# Altium project tianjin.PrjPcb
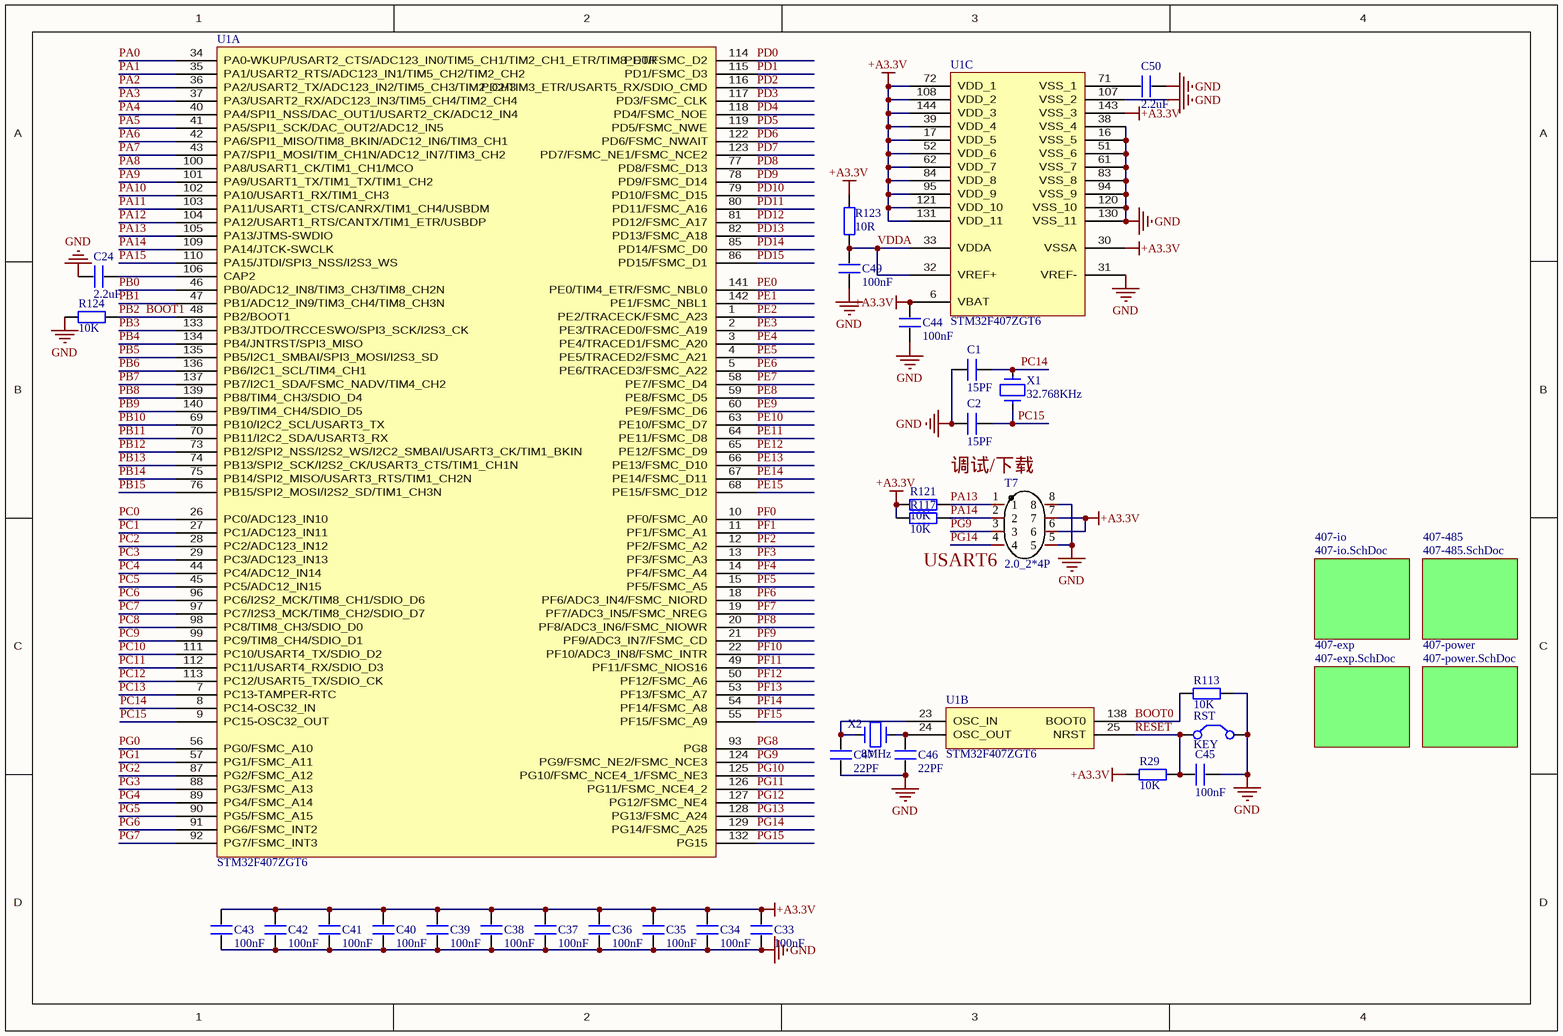
[diagram p0: 407-cpu .schdoc]
5 sheets, 300 parts. Net scope: global (net labels, ports and power ports of the same name join across sheets).
Board file: tianjin2025_4.PcbDoc
Sheets:
  407-cpu .schdoc
    407-io = 407-io.schdoc
    407-485 = 407-485.schdoc
    407-exp = 407-exp.schdoc
    407-power = 407-power.schdoc

## Sheet 407-cpu .schdoc
size A4

### Parts
C1  15PF
C2  15PF
C24  2.2uF
C33  100nF
C34  100nF
C35  100nF
C36  100nF
C37  100nF
C38  100nF
C39  100nF
C40  100nF
C41  100nF
C42  100nF
C43  100nF
C44  100nF
C45  100nF
C46  22PF
C47  22PF
C49  100nF
C50  2.2uF
R29  10K
R113  10K
R117  10K
R121  10K
R123  10R
R124  10K
RST  KEY
T7  2.0_2*4P  [2.0_2*4P]
U1  STM32F407ZGT6  (parts A,B,C of 3)
X1  32.768KHz
X2  8MHz

### Sub-sheets
407-485 = 407-485.SchDoc: no entries
407-exp = 407-exp.SchDoc: no entries
407-io = 407-io.SchDoc: no entries
407-power = 407-power.SchDoc: no entries

### Nets
+A3.3V: C33.2 C34.2 C35.2 C36.2 C37.2 C38.2 C39.2 C40.2 C41.2 C42.2 C43.2 C44.2 R29.1 R117.2 R121.2 R123.1 T7.6 T7.7 U1.6(VBAT) U1.17(VDD_5) U1.30(VSSA) U1.39(VDD_4) U1.52(VDD_6) U1.62(VDD_7) U1.72(VDD_1) U1.84(VDD_8) U1.95(VDD_9) U1.108(VDD_2) U1.121(VDD_10) U1.131(VDD_11) U1.143(VSS_3) U1.144(VDD_3)
GND: C1.2 C2.2 C24.1 C33.1 C34.1 C35.1 C36.1 C37.1 C38.1 C39.1 C40.1 C41.1 C42.1 C43.1 C44.1 C45.1 C46.1 C47.1 C49.1 C50.2 R113.2 R124.1 RST.2(C2) T7.5 T7.8 U1.16(VSS_5) U1.31(VREF-) U1.38(VSS_4) U1.51(VSS_6) U1.61(VSS_7) U1.83(VSS_8) U1.94(VSS_9) U1.107(VSS_2) U1.120(VSS_10) U1.130(VSS_11)
BOOT0: R113.1 U1.138(BOOT0)
BOOT1: R124.2 U1.48(PB2/BOOT1)  [also labelled PB2]
PA0: U1.34(PA0-WKUP/USART2_CTS/ADC123_IN0/TIM5_CH1/TIM2_CH1_ETR/TIM8_ETR)
PA1: U1.35(PA1/USART2_RTS/ADC123_IN1/TIM5_CH2/TIM2_CH2)
PA2: U1.36(PA2/USART2_TX/ADC123_IN2/TIM5_CH3/TIM2_CH3)
PA3: U1.37(PA3/USART2_RX/ADC123_IN3/TIM5_CH4/TIM2_CH4)
PA4: U1.40(PA4/SPI1_NSS/DAC_OUT1/USART2_CK/ADC12_IN4)
PA5: U1.41(PA5/SPI1_SCK/DAC_OUT2/ADC12_IN5)
PA6: U1.42(PA6/SPI1_MISO/TIM8_BKIN/ADC12_IN6/TIM3_CH1)
PA7: U1.43(PA7/SPI1_MOSI/TIM_CH1N/ADC12_IN7/TIM3_CH2)
PA8: U1.100(PA8/USART1_CK/TIM1_CH1/MCO)
PA9: U1.101(PA9/USART1_TX/TIM1_TX/TIM1_CH2)
PA10: U1.102(PA10/USART1_RX/TIM1_CH3)
PA11: U1.103(PA11/USART1_CTS/CANRX/TIM1_CH4/USBDM)
PA12: U1.104(PA12/USART1_RTS/CANTX/TIM1_ETR/USBDP)
PA13: R121.1 T7.1 U1.105(PA13/JTMS-SWDIO)
PA14: R117.1 T7.2 U1.109(PA14/JTCK-SWCLK)
PA15: U1.110(PA15/JTDI/SPI3_NSS/I2S3_WS)
PB0: U1.46(PB0/ADC12_IN8/TIM3_CH3/TIM8_CH2N)
PB1: U1.47(PB1/ADC12_IN9/TIM3_CH4/TIM8_CH3N)
PB3: U1.133(PB3/JTDO/TRCCESWO/SPI3_SCK/I2S3_CK)
PB4: U1.134(PB4/JNTRST/SPI3_MISO)
PB5: U1.135(PB5/I2C1_SMBAI/SPI3_MOSI/I2S3_SD)
PB6: U1.136(PB6/I2C1_SCL/TIM4_CH1)
PB7: U1.137(PB7/I2C1_SDA/FSMC_NADV/TIM4_CH2)
PB8: U1.139(PB8/TIM4_CH3/SDIO_D4)
PB9: U1.140(PB9/TIM4_CH4/SDIO_D5)
PB10: U1.69(PB10/I2C2_SCL/USART3_TX)
PB11: U1.70(PB11/I2C2_SDA/USART3_RX)
PB12: U1.73(PB12/SPI2_NSS/I2S2_WS/I2C2_SMBAI/USART3_CK/TIM1_BKIN)
PB13: U1.74(PB13/SPI2_SCK/I2S2_CK/USART3_CTS/TIM1_CH1N)
PB14: U1.75(PB14/SPI2_MISO/USART3_RTS/TIM1_CH2N)
PB15: U1.76(PB15/SPI2_MOSI/I2S2_SD/TIM1_CH3N)
PC0: U1.26(PC0/ADC123_IN10)
PC1: U1.27(PC1/ADC123_IN11)
PC2: U1.28(PC2/ADC123_IN12)
PC3: U1.29(PC3/ADC123_IN13)
PC4: U1.44(PC4/ADC12_IN14)
PC5: U1.45(PC5/ADC12_IN15)
PC6: U1.96(PC6/I2S2_MCK/TIM8_CH1/SDIO_D6)
PC7: U1.97(PC7/I2S3_MCK/TIM8_CH2/SDIO_D7)
PC8: U1.98(PC8/TIM8_CH3/SDIO_D0)
PC9: U1.99(PC9/TIM8_CH4/SDIO_D1)
PC10: U1.111(PC10/USART4_TX/SDIO_D2)
PC11: U1.112(PC11/USART4_RX/SDIO_D3)
PC12: U1.113(PC12/USART5_TX/SDIO_CK)
PC13: U1.7(PC13-TAMPER-RTC)
PC14: C1.1 U1.8(PC14-OSC32_IN) X1.1
PC15: C2.1 U1.9(PC15-OSC32_OUT) X1.2
PD0: U1.114(PD0/FSMC_D2)
PD1: U1.115(PD1/FSMC_D3)
PD2: U1.116(PD2/TIM3_ETR/USART5_RX/SDIO_CMD)
PD3: U1.117(PD3/FSMC_CLK)
PD4: U1.118(PD4/FSMC_NOE)
PD5: U1.119(PD5/FSMC_NWE)
PD6: U1.122(PD6/FSMC_NWAIT)
PD7: U1.123(PD7/FSMC_NE1/FSMC_NCE2)
PD8: U1.77(PD8/FSMC_D13)
PD9: U1.78(PD9/FSMC_D14)
PD10: U1.79(PD10/FSMC_D15)
PD11: U1.80(PD11/FSMC_A16)
PD12: U1.81(PD12/FSMC_A17)
PD13: U1.82(PD13/FSMC_A18)
PD14: U1.85(PD14/FSMC_D0)
PD15: U1.86(PD15/FSMC_D1)
PE0: U1.141(PE0/TIM4_ETR/FSMC_NBL0)
PE1: U1.142(PE1/FSMC_NBL1)
PE2: U1.1(PE2/TRACECK/FSMC_A23)
PE3: U1.2(PE3/TRACED0/FSMC_A19)
PE4: U1.3(PE4/TRACED1/FSMC_A20)
PE5: U1.4(PE5/TRACED2/FSMC_A21)
PE6: U1.5(PE6/TRACED3/FSMC_A22)
PE7: U1.58(PE7/FSMC_D4)
PE8: U1.59(PE8/FSMC_D5)
PE9: U1.60(PE9/FSMC_D6)
PE10: U1.63(PE10/FSMC_D7)
PE11: U1.64(PE11/FSMC_D8)
PE12: U1.65(PE12/FSMC_D9)
PE13: U1.66(PE13/FSMC_D10)
PE14: U1.67(PE14/FSMC_D11)
PE15: U1.68(PE15/FSMC_D12)
PF0: U1.10(PF0/FSMC_A0)
PF1: U1.11(PF1/FSMC_A1)
PF2: U1.12(PF2/FSMC_A2)
PF3: U1.13(PF3/FSMC_A3)
PF4: U1.14(PF4/FSMC_A4)
PF5: U1.15(PF5/FSMC_A5)
PF6: U1.18(PF6/ADC3_IN4/FSMC_NIORD)
PF7: U1.19(PF7/ADC3_IN5/FSMC_NREG)
PF8: U1.20(PF8/ADC3_IN6/FSMC_NIOWR)
PF9: U1.21(PF9/ADC3_IN7/FSMC_CD)
PF10: U1.22(PF10/ADC3_IN8/FSMC_INTR)
PF11: U1.49(PF11/FSMC_NIOS16)
PF12: U1.50(PF12/FSMC_A6)
PF13: U1.53(PF13/FSMC_A7)
PF14: U1.54(PF14/FSMC_A8)
PF15: U1.55(PF15/FSMC_A9)
PG0: U1.56(PG0/FSMC_A10)
PG1: U1.57(PG1/FSMC_A11)
PG2: U1.87(PG2/FSMC_A12)
PG3: U1.88(PG3/FSMC_A13)
PG4: U1.89(PG4/FSMC_A14)
PG5: U1.90(PG5/FSMC_A15)
PG6: U1.91(PG6/FSMC_INT2)
PG7: U1.92(PG7/FSMC_INT3)
PG8: U1.93(PG8)
PG9: T7.3 U1.124(PG9/FSMC_NE2/FSMC_NCE3)
PG10: U1.125(PG10/FSMC_NCE4_1/FSMC_NE3)
PG11: U1.126(PG11/FSMC_NCE4_2)
PG12: U1.127(PG12/FSMC_NE4)
PG13: U1.128(PG13/FSMC_A24)  [project net GPS]
PG14: T7.4 U1.129(PG14/FSMC_A25)
PG15: U1.132(PG15)
RESET: C45.2 R29.2 RST.1(C1) U1.25(NRST)
VDDA: C49.2 R123.2 U1.32(VREF+) U1.33(VDDA)
NetC24_2: C24.2 U1.106(CAP2)
NetC46_2: C46.2 U1.24(OSC_OUT) X2.2
NetC47_2: C47.2 U1.23(OSC_IN) X2.1
NetC50_1: C50.1 U1.71(VSS_1)

### Notes on the sheet
- 调试/下载
- USART6

### Library data of the parts
C1 C2 C24 C33-C47 C49 C50 = C
R29 R113 R117 R121 R123 R124 = Res2: Resistor
RST = Jumper: Jumper Wire; Published: 24-Mar-1999; LatestRevisionDate: 17-Jul-2002; LatestRevisionNote: Re-released for DXP Platform.; PackageReference: RAD-0.2; Publisher: Altium Limited
U1 = STM32F103ZET6_1
X1 X2 = XTAL: Crystal Oscillator

## Sheet 407-io.schdoc
size A4
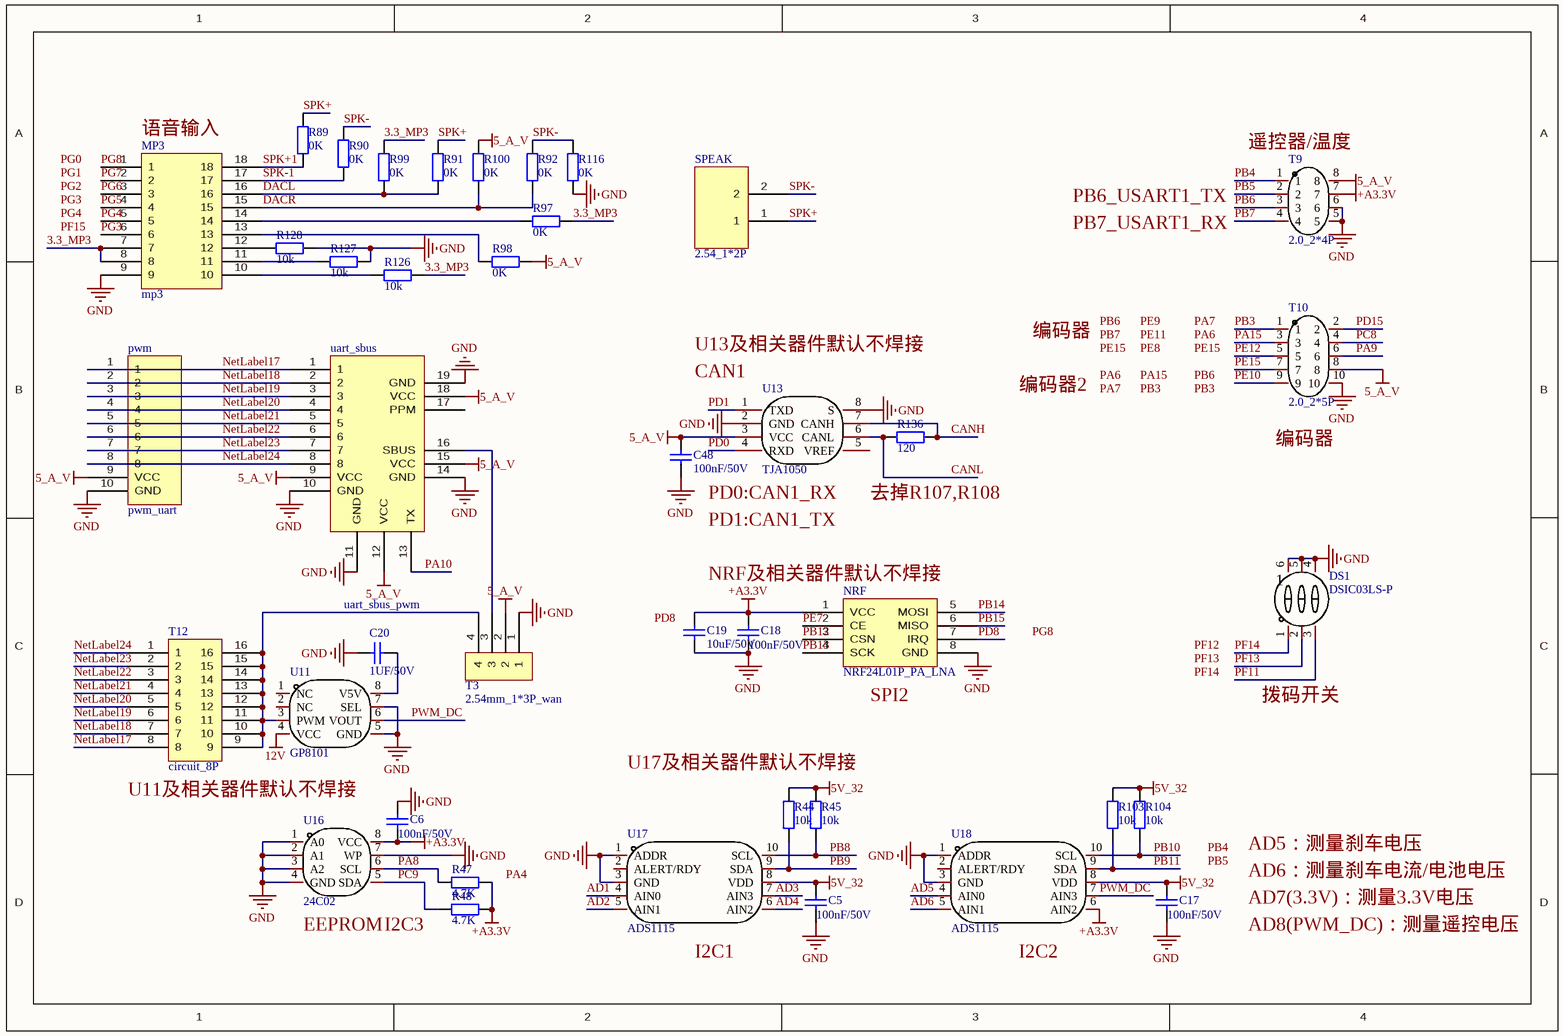
[diagram p1: 407-io.schdoc]

### Parts
C5  100nF/50V
C6  100nF/50V
C17  100nF/50V
C18  100nF/50V
C19  10uF/50V
C20  1UF/50V
C48  100nF/50V
DS1  DSIC03LS-P  [DS1040-03RN]
MP3  mp3  [MP3]
NRF  NRF24L01P_PA_LNA  [NRF24L01P_PA_LNA]
pwm  pwm_uart  [pwm_uart]
R44  10k  [R0603_L]
R45  10k  [R0603_L]
R47  4.7K
R48  4.7K
R89  0K  [R0603_L]
R90  0K  [R0603_L]
R91  0K  [R0603_L]
R92  0K  [R0603_L]
R97  0K  [R0603_L]
R98  0K  [R0603_L]
R99  0K  [R0603_L]
R100  0K  [R0603_L]
R103  10k  [R0603_L]
R104  10k  [R0603_L]
R116  0K  [R0603_L]
R126  10k  [R0603_L]
R127  10k  [R0603_L]
R128  10k  [R0603_L]
R136  120
SPEAK  2.54_1*2P  [2.54_1*2P]
T3  2.54mm_1*3P_wan
T9  2.0_2*4P  [2.0_2*4P]
T10  2.0_2*5P  [2.0_2*5P]
T12  circuit_8P  [circuit_8P]
U11  GP8101  [GP8101]
U13  TJA1050  [TJA1050]
U16  24C02  [24C02]
U17  ADS1115  [ADS1115]
U18  ADS1115  [ADS1115]
uart_sbus  uart_sbus_pwm  [uart_sbus_pwm]

### Nets
5_A_V: C48.2 pwm.9(VCC) R98.2 R100.2 T3.2 T9.8 T10.8 U13.3(VCC) uart_sbus.9(VCC) uart_sbus.12(VCC) uart_sbus.15(VCC) uart_sbus.18(VCC)
5V_32: C5.1 C17.1 R44.1 R45.1 R103.1 R104.1 U17.8(VDD) U18.8(VDD)
12V: U11.4(VCC)
+A3.3V: C6.2 C18.1 C19.1 NRF.1(VCC) R47.2 R48.2 T9.7 U16.8(VCC) U18.6(AIN2)
GND: C5.2 C6.1 C17.2 C18.2 C19.2 C20.2 C48.1 DS1.4(PIN4) DS1.5(PIN5) DS1.6(PIN6) MP3.9 NRF.8(GND) pwm.10(GND) R116.1 R127.2 R128.2 T3.1 T9.5 T9.6 T10.10 U11.5(GND) U11.7(SEL) U13.2(GND) U13.8(S) U16.1(A0) U16.2(A1) U16.3(A2) U16.4(GND) U16.7(WP) U17.1(ADDR) U17.3(GND) U18.1(ADDR) U18.3(GND) uart_sbus.10(GND) uart_sbus.11(GND) uart_sbus.14(GND) uart_sbus.19(GND)
3.3_MP3: MP3.7 MP3.8 R97.2 R99.2 R126.2
AD1: U17.4(AIN0)
AD2: U17.5(AIN1)
AD3: U17.7(AIN3)
AD4: U17.6(AIN2)
AD5: U18.4(AIN0)
AD6: U18.5(AIN1)
CANH: R136.2 U13.7(CANH)
CANL: R136.1 U13.6(CANL)
DACL: MP3.16 R91.1 R99.1
DACR: MP3.15 R92.1 R100.1
NetLabel17: pwm.1 T12.8 uart_sbus.1
NetLabel18: pwm.2 T12.7 uart_sbus.2
NetLabel19: pwm.3 T12.6 uart_sbus.3
NetLabel20: pwm.4 T12.5 uart_sbus.4
NetLabel21: pwm.5 T12.4 uart_sbus.5
NetLabel22: pwm.6 T12.3 uart_sbus.6
NetLabel23: pwm.7 T12.2 uart_sbus.7
NetLabel24: pwm.8 T12.1 uart_sbus.8
PA8: R47.1 U16.6(SCL)
PA9: T10.6
PA10: uart_sbus.13(TX)
PA15: T10.3
PB3: T10.1
PB4: T9.1
PB5: T9.2
PB6: T9.3
PB7: T9.4
PB8: R45.2 U17.10(SCL)
PB9: R44.2 U17.9(SDA)
PB10: R104.2 U18.10(SCL)
PB11: R103.2 U18.9(SDA)
PB12: NRF.3(CSN)
PB13: NRF.4(SCK)
PB14: NRF.5(MOSI)
PB15: NRF.6(MISO)
PC8: T10.4
PC9: R48.1 U16.5(SDA)
PD0: U13.4(RXD)
PD1: U13.1(TXD)
PD8: NRF.7(IRQ)
PD15: T10.2
PE7: NRF.2(CE)
PE10: T10.9
PE12: T10.5
PE15: T10.7
PF11: DS1.3(PIN3)
PF13: DS1.2(PIN2)
PF14: DS1.1(PIN1)
PG3: MP3.6
PG4: MP3.5
PG5: MP3.4
PG6: MP3.3
PG7: MP3.2
PG8: MP3.1
PWM_DC: U11.6(VOUT) U18.7(AIN3)
SPK+: R89.2 R91.2 SPEAK.1
SPK+1: MP3.18 R89.1
SPK-: R90.2 R92.2 R116.2 SPEAK.2
SPK-1: MP3.17 R90.1
NetC20_1: C20.1 U11.8(V5V)
NetMP3_10: MP3.10 R126.1
NetMP3_11: MP3.11 R127.1
NetMP3_12: MP3.12 R128.1
NetMP3_13: MP3.13 R98.1
NetMP3_14: MP3.14 R97.1
NetT3_3: T3.3 uart_sbus.16(SBUS)
NetT3_4: T3.4 T12.9 T12.10 T12.11 T12.12 T12.13 T12.14 T12.15 T12.16 U11.3(PWM)

Not connected (* = marked no-connect by the designer): U11 1(NC) 2(NC); U13 5(VREF); U17 2(ALERT/RDY); U18 2(ALERT/RDY); uart_sbus 17(PPM)

### Notes on the sheet
- (near MP3) 语音输入
- (near T9) 遥控器/温度
- PB6_USART1_TX
- PB7_USART1_RX
- (near U13) CAN1
- U13及相关器件默认不焊接
- 编码器
- 编码器2
- (near T10) 编码器
- PD0:CAN1_RX
- 去掉R107,R108
- PD1:CAN1_TX
- NRF及相关器件默认不焊接
- (near NRF) SPI2
- 拨码开关
- U17及相关器件默认不焊接
- (near T12) U11及相关器件默认不焊接
- AD5：测量刹车电压
- AD7(3.3V)：测量3.3V电压
- AD6：测量刹车电流/电池电压
- (near U16) EEPROM
- I2C3
- (near U17) I2C1
- (near U18) I2C2
- AD8(PWM_DC)：测量遥控电压
- Labels drawn without touching a wire or pin: PA4, PA6, PA7, PA15, PB3, PB4, PB5, PB6, PB7, PD8, PE8, PE9, PE11, PE15, PF12, PF13, PF14, PF15, PG0, PG1, PG2, PG3, PG4, PG8

### Library data of the parts
C5 C6 C17-C20 C48 = Cap: Capacitor; Published: 8-Jun-2000; LatestRevisionDate: 17-Jul-2002; LatestRevisionNote: Re-released for DXP Platform.; PackageReference: RAD-0.3; Publisher: Altium Limited; PackageDescription: Radial Cap, Thru-Hole; 2 Leads; 0.3 in Pin Spacing
  C5 C6 C17 C18 C48: Value: 100nF/50V
  C19: Value: 10uF/50V
  C20: Value: 1UF/50V
R44 R45 R103 R104 R126-R128 = Res2: Resistor; Value: 0K; Published: 8-Jun-2000; LatestRevisionDate: 17-Jul-2002; LatestRevisionNote: Re-released for DXP Platform.; PackageReference: AXIAL-0.4; Publisher: Altium Limited; PackageDescription: Axial Device, Thru-Hole; 2 Leads; 0.4 in Pin Spacing
R47 R48 R89-R92 R97-R100 R116 = Res2: Resistor; Published: 8-Jun-2000; LatestRevisionDate: 17-Jul-2002; LatestRevisionNote: Re-released for DXP Platform.; PackageReference: AXIAL-0.4; Publisher: Altium Limited; PackageDescription: Axial Device, Thru-Hole; 2 Leads; 0.4 in Pin Spacing
  R47 R48: Value: 4.7K
  R89-R92 R97-R100 R116: Value: 0K
R136 = Res2: Resistor; Value: 120R; Published: 8-Jun-2000; LatestRevisionDate: 17-Jul-2002; LatestRevisionNote: Re-released for DXP Platform.; PackageReference: AXIAL-0.4; Publisher: Altium Limited; PackageDescription: Axial Device, Thru-Hole; 2 Leads; 0.4 in Pin Spacing

## Sheet 407-485.schdoc
size A4
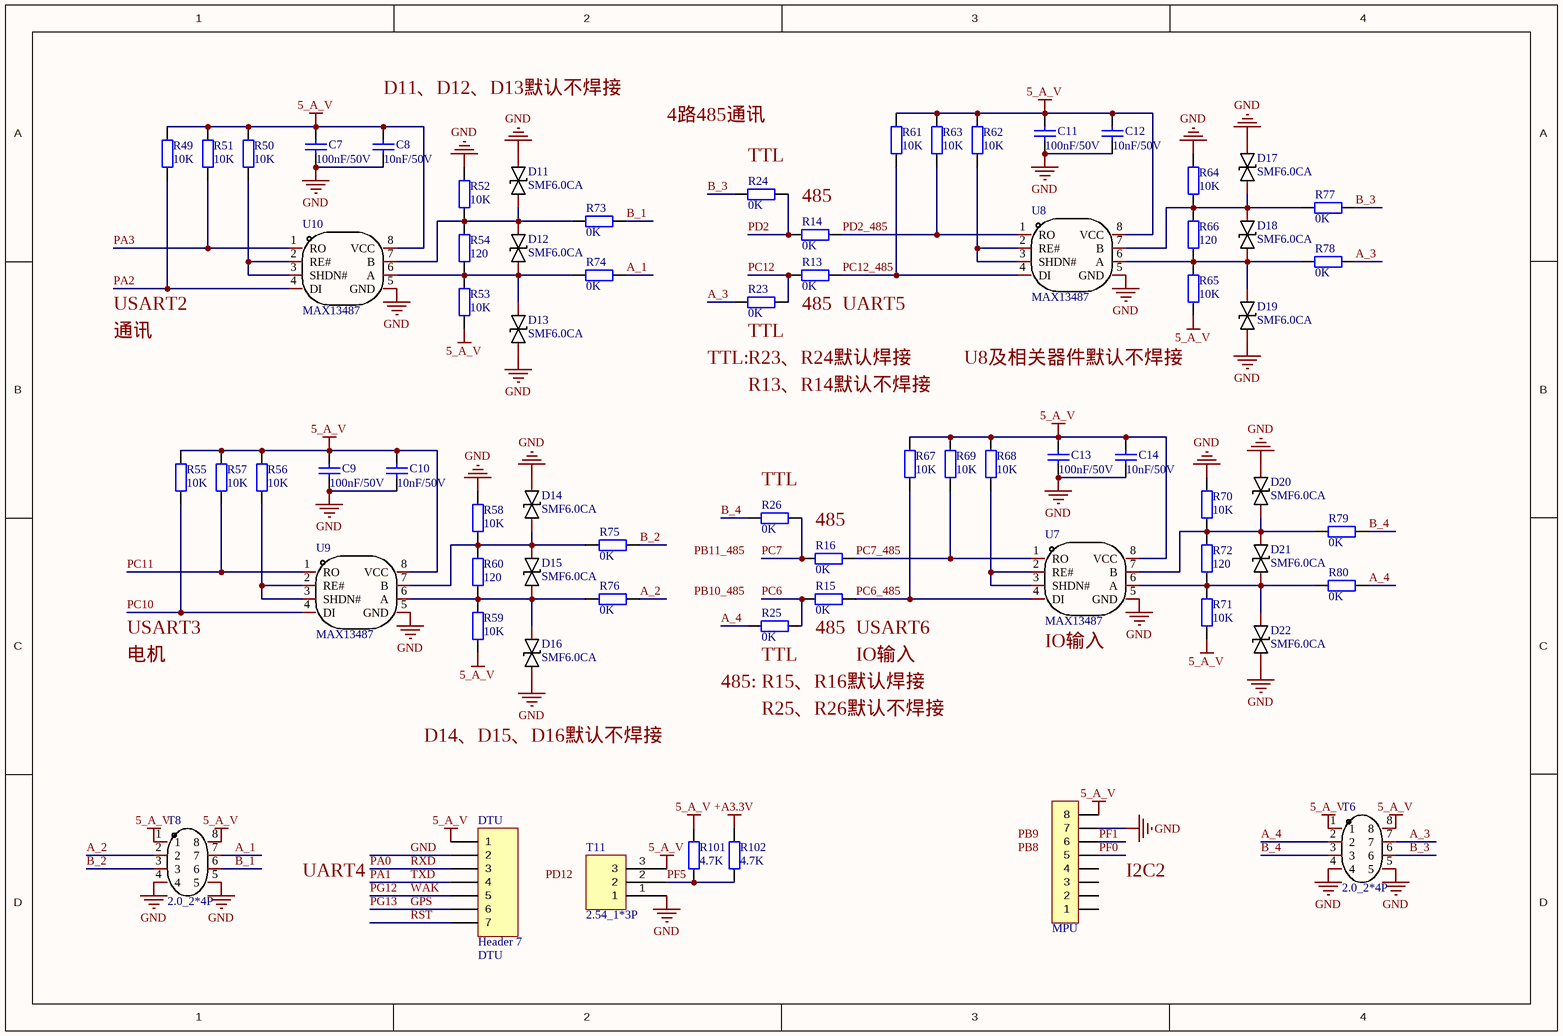
[diagram p2: 407-485.schdoc]

### Parts
C7  100nF/50V
C8  10nF/50V
C9  100nF/50V
C10  10nF/50V
C11  100nF/50V
C12  10nF/50V
C13  100nF/50V
C14  10nF/50V
D11  SMF6.0CA  [SMF6.0CA]
D12  SMF6.0CA  [SMF6.0CA]
D13  SMF6.0CA  [SMF6.0CA]
D14  SMF6.0CA  [SMF6.0CA]
D15  SMF6.0CA  [SMF6.0CA]
D16  SMF6.0CA  [SMF6.0CA]
D17  SMF6.0CA  [SMF6.0CA]
D18  SMF6.0CA  [SMF6.0CA]
D19  SMF6.0CA  [SMF6.0CA]
D20  SMF6.0CA  [SMF6.0CA]
D21  SMF6.0CA  [SMF6.0CA]
D22  SMF6.0CA  [SMF6.0CA]
DTU  Header 7  [HDR1X7]
MPU  HDR-1X8  [HDR2.54-M-LI-8P]  (value not drawn)
R13  0K  [R0603_L]
R14  0K  [R0603_L]
R15  0K  [R0603_L]
R16  0K  [R0603_L]
R23  0K  [R0603_L]
R24  0K  [R0603_L]
R25  0K  [R0603_L]
R26  0K  [R0603_L]
R49  10K  [R0603_L]
R50  10K  [R0603_L]
R51  10K  [R0603_L]
R52  10K  [R0603_L]
R53  10K  [R0603_L]
R54  120  [R0603_L]
R55  10K  [R0603_L]
R56  10K  [R0603_L]
R57  10K  [R0603_L]
R58  10K  [R0603_L]
R59  10K  [R0603_L]
R60  120  [R0603_L]
R61  10K  [R0603_L]
R62  10K  [R0603_L]
R63  10K  [R0603_L]
R64  10K  [R0603_L]
R65  10K  [R0603_L]
R66  120  [R0603_L]
R67  10K  [R0603_L]
R68  10K  [R0603_L]
R69  10K  [R0603_L]
R70  10K  [R0603_L]
R71  10K  [R0603_L]
R72  120  [R0603_L]
R73  0K  [R0603_L]
R74  0K  [R0603_L]
R75  0K  [R0603_L]
R76  0K  [R0603_L]
R77  0K  [R0603_L]
R78  0K  [R0603_L]
R79  0K  [R0603_L]
R80  0K  [R0603_L]
R101  4.7K
R102  4.7K
T6  2.0_2*4P  [2.0_2*4P]
T8  2.0_2*4P  [2.0_2*4P]
T11  2.54_1*3P  [2.54_1*3P]
U7  MAX13487  [MAX13487]
U8  MAX13487  [MAX13487]
U9  MAX13487  [MAX13487]
U10  MAX13487  [MAX13487]

### Nets
5_A_V: C7.1 C8.1 C9.1 C10.1 C11.1 C12.1 C13.1 C14.1 DTU.1 MPU.8 R49.2 R50.2 R51.2 R53.1 R55.2 R56.2 R57.2 R59.1 R61.2 R62.2 R63.2 R65.1 R67.2 R68.2 R69.2 R71.1 R101.2 T6.1 T6.8 T8.1 T8.8 T11.3 U7.8(VCC) U8.8(VCC) U9.8(VCC) U10.8(VCC)
+A3.3V: R102.2
GND: C7.2 C8.2 C9.2 C10.2 C11.2 C12.2 C13.2 C14.2 D11.2 D13.1 D14.2 D16.1 D17.2 D19.1 D20.2 D22.1 DTU.2 MPU.7 R52.2 R58.2 R64.2 R70.2 T6.4 T6.5 T8.4 T8.5 T11.1 U7.5(GND) U8.5(GND) U9.5(GND) U10.5(GND)
A_1: R74.1 T8.7
A_2: R76.1 T8.2
A_3: R23.2 R78.1 T6.7
A_4: R25.2 R80.1 T6.2
B_1: R73.1 T8.6
B_2: R75.1 T8.3
B_3: R24.2 R77.1 T6.6
B_4: R26.1 R79.1 T6.3
GPS: DTU.6  [also labelled PG13]
PA0: DTU.3  [also labelled RXD]
PA1: DTU.4  [also labelled TXD]
PA2: R49.1 U10.4(DI)
PA3: R51.1 U10.1(RO)
PC6: R15.2 R25.1
PC6_485: R15.1 R67.1 U7.4(DI)
PC7: R16.2 R26.2
PC7_485: R16.1 R69.1 U7.1(RO)
PC10: R55.1 U9.4(DI)
PC11: R57.1 U9.1(RO)
PC12: R13.2 R23.1
PC12_485: R13.1 R61.1 U8.4(DI)
PD2: R14.2 R24.1
PD2_485: R14.1 R63.1 U8.1(RO)
PF0: MPU.5
PF1: MPU.6
PF5: R101.1 R102.1 T11.2
PG12: DTU.5  [also labelled WAK]
RST: DTU.7
NetD11_1: D11.1 D12.2 R52.1 R54.2 R73.2 U10.7(B)
NetD12_1: D12.1 D13.2 R53.2 R54.1 R74.2 U10.6(A)
NetD14_1: D14.1 D15.2 R58.1 R60.2 R75.2 U9.7(B)
NetD15_1: D15.1 D16.2 R59.2 R60.1 R76.2 U9.6(A)
NetD17_1: D17.1 D18.2 R64.1 R66.2 R77.2 U8.7(B)
NetD18_1: D18.1 D19.2 R65.2 R66.1 R78.2 U8.6(A)
NetD20_1: D20.1 D21.2 R70.1 R72.2 R79.2 U7.7(B)
NetD21_1: D21.1 D22.2 R71.2 R72.1 R80.2 U7.6(A)
NetR50_1: R50.1 U10.2(RE#) U10.3(SHDN#)
NetR56_1: R56.1 U9.2(RE#) U9.3(SHDN#)
NetR62_1: R62.1 U8.2(RE#) U8.3(SHDN#)
NetR68_1: R68.1 U7.2(RE#) U7.3(SHDN#)

Not connected (* = marked no-connect by the designer): MPU 1 2 3 4

### Notes on the sheet
- (near C8) D11、D12、D13默认不焊接
- 4路485通讯
- (near R24) TTL
- 485
- USART2
- (near R13) UART5
- 通讯
- (near R23) TTL:
- (near R23) TTL
- R23、R24默认焊接
- U8及相关器件默认不焊接
- R13、R14默认不焊接
- (near R26) TTL
- USART3
- (near R15) USART6
- (near U7) IO输入
- 电机
- (near R25) 485:
- R15、R16默认焊接
- R25、R26默认不焊接
- (near R25) TTL
- IO输入
- D14、D15、D16默认不焊接
- UART4
- (near MPU) I2C2
- (near DTU) DTU
- Labels drawn without touching a wire or pin: PB8, PB9, PB10_485, PB11_485, PD12

### Library data of the parts
C7-C14 = Cap: Capacitor; Published: 8-Jun-2000; LatestRevisionDate: 17-Jul-2002; LatestRevisionNote: Re-released for DXP Platform.; PackageReference: RAD-0.3; Publisher: Altium Limited; PackageDescription: Radial Cap, Thru-Hole; 2 Leads; 0.3 in Pin Spacing
  C7 C9 C11 C13: Value: 100nF/50V
  C8 C10 C12 C14: Value: 10nF/50V
DTU = Header 7: Header, 7-Pin; LatestRevisionDate: 17-Jul-2002; LatestRevisionNote: Re-released for DXP Platform.; Publisher: Altium Limited
MPU = Header 8: 8P接插件; 版权归属: 封装库来自淘宝 ID：黄晶宝石; BOM名称: 8P接插件; 学习资源: https://shop463601444.taobao.com
R13-R16 R23-R26 R73-R80 R101 R102 = Res2: Resistor; Published: 8-Jun-2000; LatestRevisionDate: 17-Jul-2002; LatestRevisionNote: Re-released for DXP Platform.; PackageReference: AXIAL-0.4; Publisher: Altium Limited; PackageDescription: Axial Device, Thru-Hole; 2 Leads; 0.4 in Pin Spacing
  R13-R16 R23-R26 R73-R80: Value: 0K
  R101 R102: Value: 4.7K
R49-R72 = Res2: Resistor; Value: 0K; Published: 8-Jun-2000; LatestRevisionDate: 17-Jul-2002; LatestRevisionNote: Re-released for DXP Platform.; PackageReference: AXIAL-0.4; Publisher: Altium Limited; PackageDescription: Axial Device, Thru-Hole; 2 Leads; 0.4 in Pin Spacing

## Sheet 407-exp.schdoc
size A4
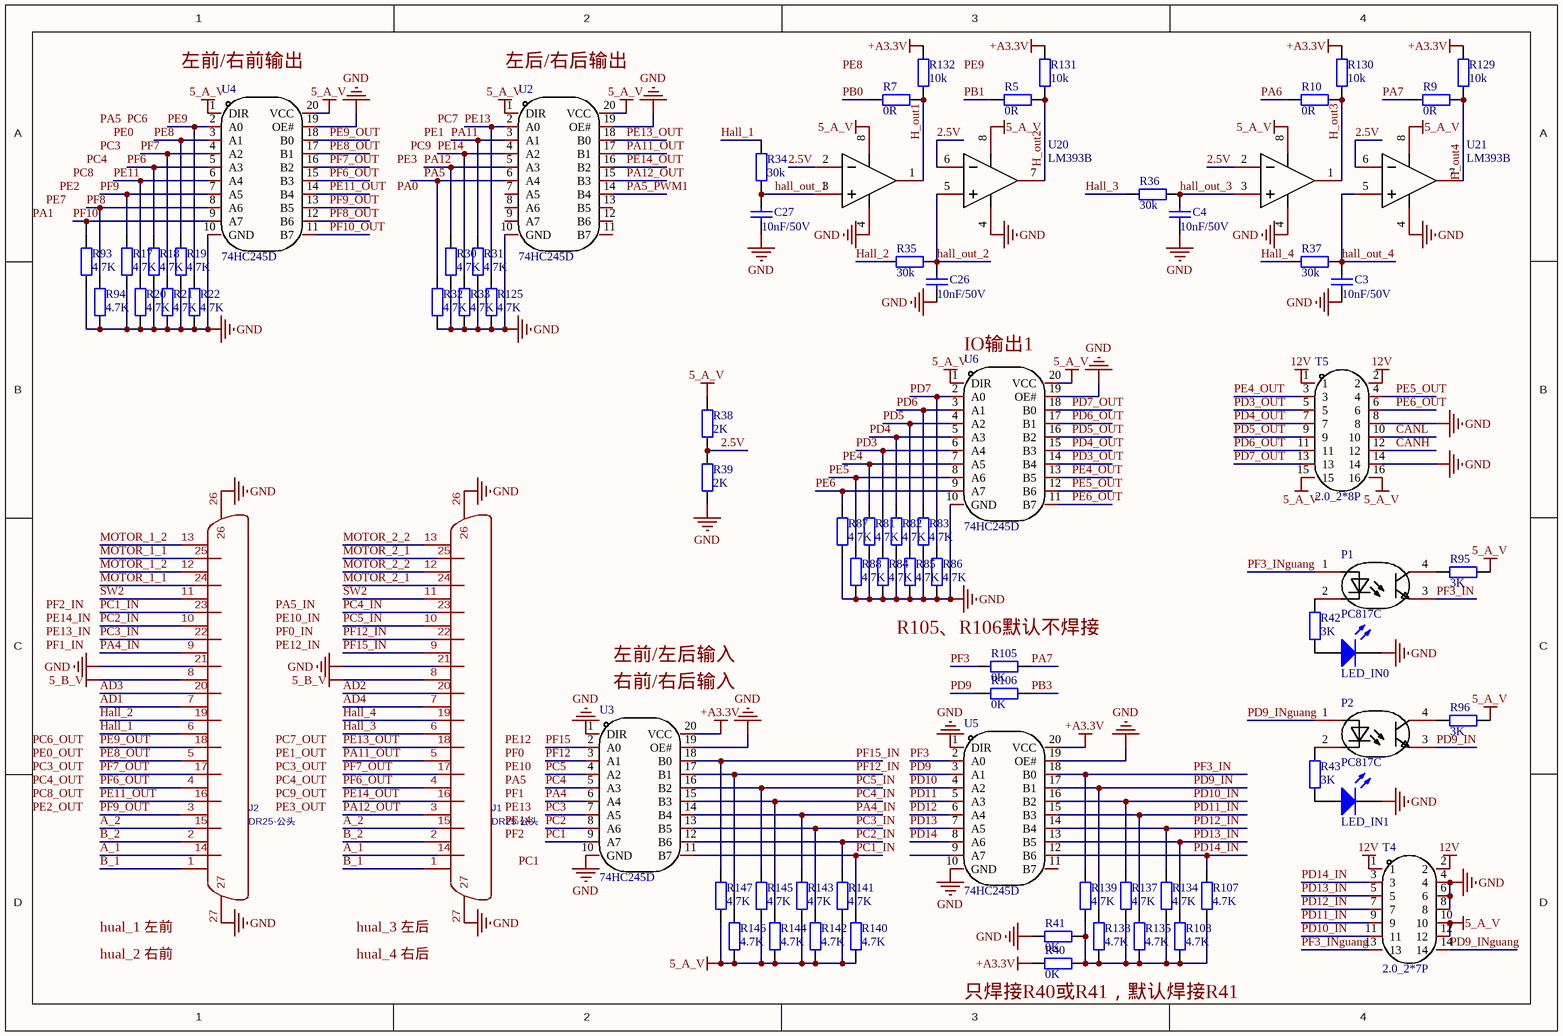
[diagram p3: 407-exp.schdoc]

### Parts
C3  10nF/50V
C4  10nF/50V
C26  10nF/50V
C27  10nF/50V
J1  DR25-公头
J2  DR25-公头
LED_IN0  LED  [LED]  (value not drawn)
LED_IN1  LED  [LED]  (value not drawn)
P1  PC817C  [PC817C]
P2  PC817C  [PC817C]
R5  0R  [R0603_L]
R7  0R  [R0603_L]
R9  0R  [R0603_L]
R10  0R  [R0603_L]
R17  4.7K  [R0603_L]
R18  4.7K  [R0603_L]
R19  4.7K  [R0603_L]
R20  4.7K  [R0603_L]
R21  4.7K  [R0603_L]
R22  4.7K  [R0603_L]
R30  4.7K  [R0603_L]
R31  4.7K  [R0603_L]
R32  4.7K  [R0603_L]
R33  4.7K  [R0603_L]
R34  30k  [R0603_L]
R35  30k  [R0603_L]
R36  30k  [R0603_L]
R37  30k  [R0603_L]
R38  2K
R39  2K
R40  0K  [R0603_L]
R41  0K  [R0603_L]
R42  3K
R43  3K
R81  4.7K
R82  4.7K
R83  4.7K
R84  4.7K
R85  4.7K
R86  4.7K
R87  4.7K
R88  4.7K
R93  4.7K  [R0603_L]
R94  4.7K  [R0603_L]
R95  3K
R96  3K
R105  0K  [R0603_L]
R106  0K  [R0603_L]
R107  4.7K
R108  4.7K
R125  4.7K  [R0603_L]
R129  10k  [R0603_L]
R130  10k  [R0603_L]
R131  10k  [R0603_L]
R132  10k  [R0603_L]
R134  4.7K
R135  4.7K
R137  4.7K
R138  4.7K
R139  4.7K
R140  4.7K  [R0603_L]
R141  4.7K  [R0603_L]
R142  4.7K  [R0603_L]
R143  4.7K  [R0603_L]
R144  4.7K  [R0603_L]
R145  4.7K  [R0603_L]
R146  4.7K  [R0603_L]
R147  4.7K  [R0603_L]
T4  2.0_2*7P  [2.0_2*7P]
T5  2.0_2*8P  [2.0_2*8P]
U2  74HC245D  [74HC245D]
U3  74HC245D  [74HC245D]
U4  74HC245D  [74HC245D]
U5  74HC245D  [74HC245D]
U6  74HC245D  [74HC245D]
U20  LM393B  [LM393B]
U21  LM393B  [LM393B]

### Nets
5_A_V: R38.1 R95.2 R96.2 R140.1 R141.1 R142.1 R143.1 R144.1 R145.1 R146.1 R147.1 T4.10 T4.12 T5.15 T5.16 U2.1(DIR) U2.20(VCC) U4.1(DIR) U4.20(VCC) U6.1(DIR) U6.20(VCC) U20.8(VCC) U21.8(VCC)
5_B_V: J1.8 J2.8
12V: T4.1 T4.2 T5.1 T5.2
+A3.3V: R40.1 R129.1 R130.1 R131.1 R132.1 U3.20(VCC) U5.20(VCC)
GND: C3.2 C4.2 C26.2 C27.2 J1.21 J1.26 J1.27 J2.21 J2.26 J2.27 LED_IN0.2(K) LED_IN1.2(K) R17.1 R18.1 R19.1 R20.1 R21.1 R22.1 R30.1 R31.1 R32.1 R33.1 R39.2 R41.1 R81.1 R82.1 R83.1 R84.1 R85.1 R86.1 R87.1 R88.1 R93.1 R94.1 R125.1 T4.4 T4.6 T4.8 T5.8 T5.14 U2.10(GND) U2.19(OE#) U3.1(DIR) U3.10(GND) U3.19(OE#) U4.10(GND) U4.19(OE#) U5.1(DIR) U5.10(GND) U5.19(OE#) U6.10(GND) U6.19(OE#) U20.4(GND) U21.4(GND)
MOTOR_1_1: J2.24 J2.25
MOTOR_2_1: J1.24 J1.25
2.5V: R38.2 R39.1 U20.2(1IN-) U20.6(1IN-) U21.2(1IN-) U21.6(1IN-)
A_1: J1.14 J2.14
A_2: J1.15 J2.15
AD1: J2.7
AD2: J1.20
AD3: J2.20
AD4: J1.7
B_1: J1.1 J2.1
B_2: J1.2 J2.2
CANH: T5.12
CANL: T5.10
H_out1: R7.2 R132.2 U20.1(1OUT)
H_out2: R5.2 R131.2 U20.7(1OUT)
H_out3: R10.2 R130.2 U21.1(1OUT)
H_out4: R9.2 R129.2 U21.7(1OUT)
Hall_1: J2.6 R34.1
Hall_2: J2.19 R35.1
Hall_3: J1.6 R36.1
Hall_4: J1.19 R37.1
hall_out_1: C27.1 R34.2 U20.3(1IN+)
hall_out_2: C26.1 R35.2 U20.5(1IN+)
hall_out_3: C4.1 R36.2 U21.3(1IN+)
hall_out_4: C3.1 R37.2 U21.5(1IN+)
MOTOR_1_2: J2.12 J2.13
MOTOR_2_2: J1.12 J1.13
PA4: U3.6(A4)
PA4_IN: J2.9 R143.2 U3.14(B4)
PA5: R32.2 U2.6(A4)
PA5_PWM1: U2.14(B4)
PA6: R10.1
PA7: R9.1 R105.1
PA11: R31.2 U2.3(A1)
PA11_OUT: J1.5 U2.17(B1)
PA12: R30.2 U2.5(A3)
PA12_OUT: J1.3 U2.15(B3)
PB0: R7.1
PB1: R5.1
PB3: R106.1
PC1: U3.9(A7)
PC1_IN: J2.23 R140.2 U3.11(B7)
PC2: U3.8(A6)
PC2_IN: J2.10 R141.2 U3.12(B6)
PC3: U3.7(A5)
PC3_IN: J2.22 R142.2 U3.13(B5)
PC4: U3.5(A3)
PC4_IN: J1.23 R144.2 U3.15(B3)
PC5: U3.4(A2)
PC5_IN: J1.10 R145.2 U3.16(B2)
PD3: R84.2 U6.6(A4)
PD3_OUT: T5.5 U6.14(B4)
PD4: R82.2 U6.5(A3)
PD4_OUT: T5.7 U6.15(B3)
PD5: R85.2 U6.4(A2)
PD5_OUT: T5.9 U6.16(B2)
PD6: R83.2 U6.3(A1)
PD6_OUT: T5.11 U6.17(B1)
PD7: R86.2 U6.2(A0)
PD7_OUT: T5.13 U6.18(B0)
PD9: R106.2 U5.3(A1)
PD9_IN: P2.3 R138.2 U5.17(B1)
PD9_INguang: P2.1 T4.14
PD10: U5.4(A2)
PD10_IN: R137.2 T4.11 U5.16(B2)
PD11: U5.5(A3)
PD11_IN: R135.2 T4.9 U5.15(B3)
PD12: U5.6(A4)
PD12_IN: R134.2 T4.7 U5.14(B4)
PD13: U5.7(A5)
PD13_IN: R108.2 T4.5 U5.13(B5)
PD14: U5.8(A6)
PD14_IN: R107.2 T4.3 U5.12(B6)
PE4: R81.2 U6.7(A5)
PE4_OUT: T5.3 U6.13(B5)
PE5: R88.2 U6.8(A6)
PE5_OUT: T5.4 U6.12(B6)
PE6: R87.2 U6.9(A7)
PE6_OUT: T5.6 U6.11(B7)
PE8: R19.2 U4.3(A1)
PE8_OUT: J2.5 U4.17(B1)
PE9: R22.2 U4.2(A0)
PE9_OUT: J2.18 U4.18(B0)
PE11: R20.2 U4.6(A4)
PE11_OUT: J2.16 U4.14(B4)
PE13: R125.2 U2.2(A0)
PE13_OUT: J1.18 U2.18(B0)
PE14: R33.2 U2.4(A2)
PE14_OUT: J1.16 U2.16(B2)
PF3: R105.2 U5.2(A0)
PF3_IN: P1.3 R139.2 U5.18(B0)
PF3_INguang: P1.1 T4.13
PF6: R18.2 U4.5(A3)
PF6_OUT: J1.4 J2.4 U4.15(B3)
PF7: R21.2 U4.4(A2)
PF7_OUT: J1.17 J2.17 U4.16(B2)
PF8: R94.2 U4.8(A6)
PF8_OUT: U4.12(B6)
PF9: R17.2 U4.7(A5)
PF9_OUT: J2.3 U4.13(B5)
PF10: R93.2 U4.9(A7)
PF10_OUT: U4.11(B7)
PF12: U3.3(A1)
PF12_IN: J1.22 R146.2 U3.17(B1)
PF15: U3.2(A0)
PF15_IN: J1.9 R147.2 U3.18(B0)
SW2: J1.11 J2.11
NetLED_IN0_1: LED_IN0.1(A) R42.1
NetLED_IN1_1: LED_IN1.1(A) R43.1
NetP1_2: P1.2 R42.2
NetP1_4: P1.4 R95.1
NetP2_2: P2.2 R43.2
NetP2_4: P2.4 R96.1
NetR40_2: R40.2 R41.2 R107.1 R108.1 R134.1 R135.1 R137.1 R138.1 R139.1

Not connected (* = marked no-connect by the designer): U2 7(A5) 8(A6) 9(A7) 11(B7) 12(B6) 13(B5); U5 9(A7) 11(B7)

### Notes on the sheet
- (near U4) 左前/右前输出
- (near U2) 左后/右后输出
- (near U6) IO输出1
- R105、R106默认不焊接
- (near U3) 右前/右后输入
- 左前/左后输入
- (near J2) hual_1 左前
- hual_2 右前
- (near J1) hual_3 左后
- hual_4 右后
- 只焊接R40或R41，默认焊接R41
- Labels drawn without touching a wire or pin: PA0, PA1, PA5, PA5_IN, PC1, PC3, PC3_OUT, PC4, PC4_OUT, PC6, PC6_OUT, PC7, PC7_OUT, PC8, PC8_OUT, PC9, PC9_OUT, PE0, PE0_OUT, PE1, PE1_OUT, PE2, PE2_OUT, PE3, PE3_OUT, PE7, PE8, PE9, PE10, PE10_IN, PE12, PE12_IN, PE13, PE13_IN, PE14, PE14_IN, PF0, PF0_IN, PF1, PF1_IN, PF2, PF2_IN

### Library data of the parts
C3 C4 C26 C27 = Cap: Capacitor; Published: 8-Jun-2000; LatestRevisionDate: 17-Jul-2002; LatestRevisionNote: Re-released for DXP Platform.; PackageReference: RAD-0.3; Publisher: Altium Limited; PackageDescription: Radial Cap, Thru-Hole; 2 Leads; 0.3 in Pin Spacing; Value: 10nF/50V
J1 J2 = DR25-公头: Manufacturer Part: DMR025PF000XH00; Contributor: MR_Peng888; Supplier: LCSC; Supplier Part: C190083; spicePre: D; spiceSymbolName: DR25-公头
LED_IN0 LED_IN1 = LED: 发光二极管; 封装库来自淘宝卖家ID：黄晶宝石: 其他店铺购入均为盗版封装库，请立即申请退款，本店现金奖励20~200元
R5 R7 R9 R10 R17-R22 R30-R39 R93 R94 R125 R129-R132 R140-R147 = Res2: Resistor; Value: 0K; Published: 8-Jun-2000; LatestRevisionDate: 17-Jul-2002; LatestRevisionNote: Re-released for DXP Platform.; PackageReference: AXIAL-0.4; Publisher: Altium Limited; PackageDescription: Axial Device, Thru-Hole; 2 Leads; 0.4 in Pin Spacing
R40 R41 R81-R88 R105-R108 R134 R135 R137-R139 = Res2: Resistor; Published: 8-Jun-2000; LatestRevisionDate: 17-Jul-2002; LatestRevisionNote: Re-released for DXP Platform.; PackageReference: AXIAL-0.4; Publisher: Altium Limited; PackageDescription: Axial Device, Thru-Hole; 2 Leads; 0.4 in Pin Spacing
  R40 R41 R105 R106: Value: 0K
  R81-R88 R107 R108 R134 R135 R137-R139: Value: 4.7K
R42 R43 R95 R96 = Res2: Resistor; Value: 4.7K; Published: 8-Jun-2000; LatestRevisionDate: 17-Jul-2002; LatestRevisionNote: Re-released for DXP Platform.; PackageReference: AXIAL-0.4; Publisher: Altium Limited; PackageDescription: Axial Device, Thru-Hole; 2 Leads; 0.4 in Pin Spacing

## Sheet 407-power.schdoc
size A4
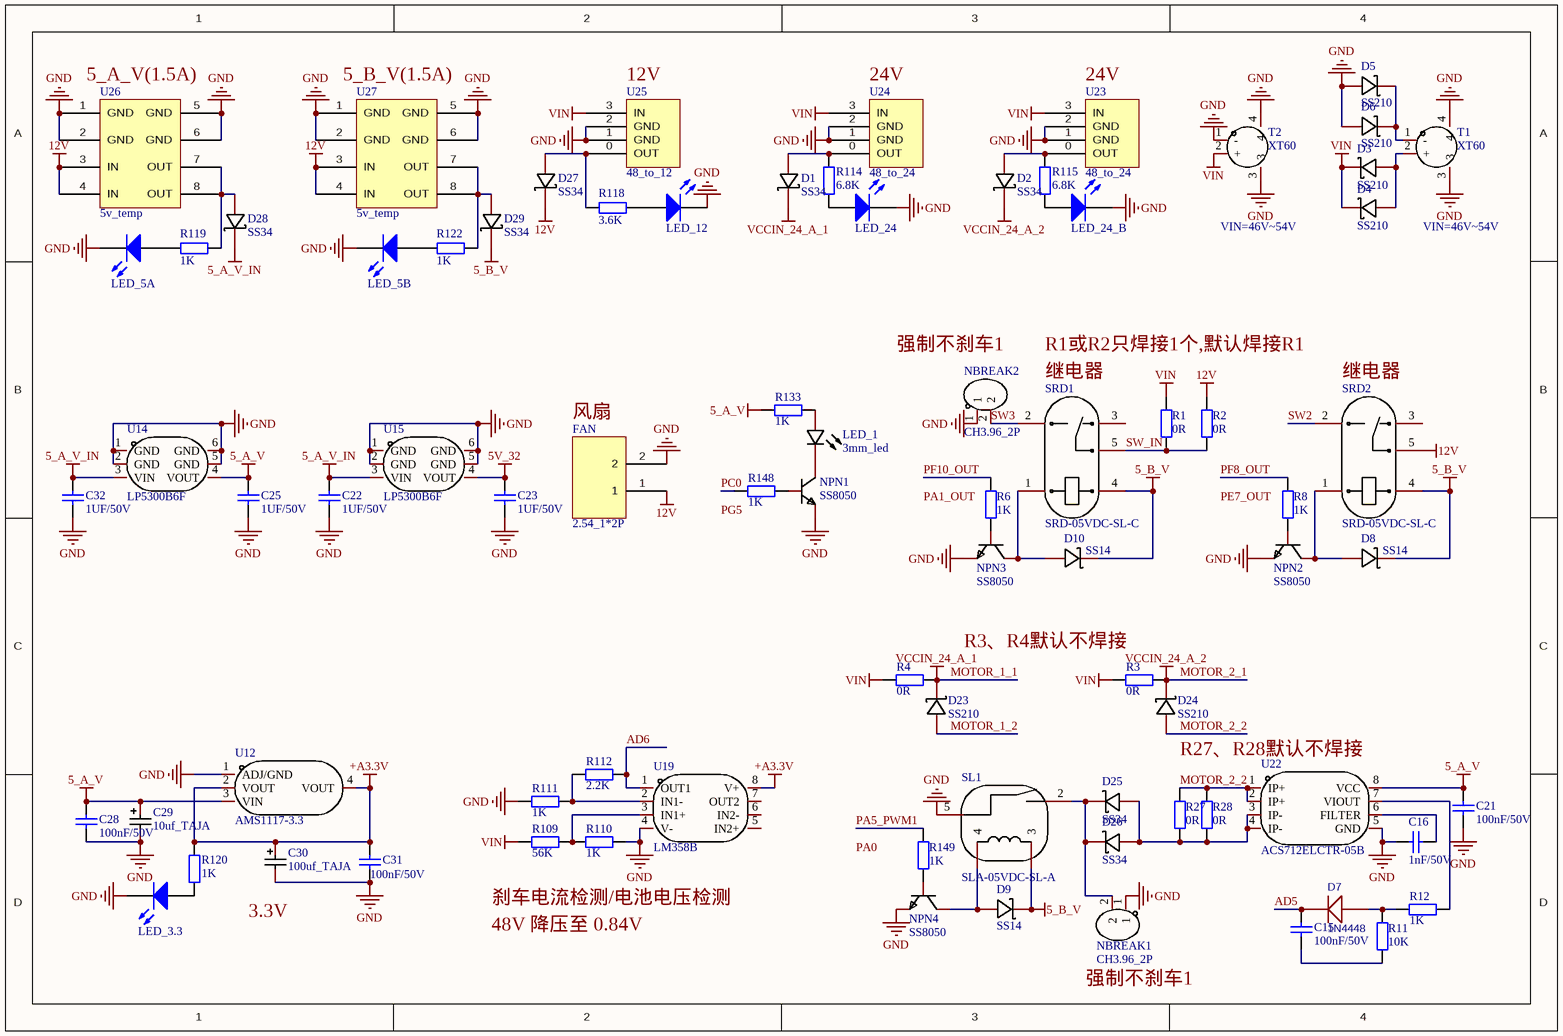
[diagram p4: 407-power.schdoc]

### Parts
C15  100nF/50V
C16  1nF/50V
C21  100nF/50V
C22  1UF/50V
C23  1UF/50V
C25  1UF/50V
C28  100nF/50V
C29  10uf_TAJA  [10uf_TAJA]
C30  100uf_TAJA  [100uf_TAJA]
C31  100nF/50V
C32  1UF/50V
D1  SS34  [SS34]
D2  SS34  [SS34]
D3  SS210  [SS210]
D4  SS210  [SS210]
D5  SS210  [SS210]
D6  SS210  [SS210]
D7  1N4448
D8  SS14  [SS14]
D9  SS14  [SS14]
D10  SS14  [SS14]
D23  SS210  [SS210]
D24  SS210  [SS210]
D25  SS34  [SS34]
D26  SS34  [SS34]
D27  SS34  [SS34]
D28  SS34  [SS34]
D29  SS34  [SS34]
FAN  2.54_1*2P  [2.54_1*2P]
LED_1  3mm_led  [3mm_led]
LED_3.3  LED  [LED]  (value not drawn)
LED_5A  LED  [LED]  (value not drawn)
LED_5B  LED  [LED]  (value not drawn)
LED_12  LED  [LED]  (value not drawn)
LED_24  LED  [LED]  (value not drawn)
LED_24_B  LED  [LED]  (value not drawn)
NBREAK1  CH3.96_2P  [CH3.96_2P]
NBREAK2  CH3.96_2P
NPN1  SS8050  [SS8050]
NPN2  SS8050  [SS8050]
NPN3  SS8050  [SS8050]
NPN4  SS8050  [SS8050]
R1  0R  [R1206_M]
R2  0R  [R1206_M]
R3  0R  [R1206_M]
R4  0R  [R1206_M]
R6  1K
R8  1K
R11  10K
R12  1K
R27  0R  [R1206_M]
R28  0R  [R1206_M]
R109  56K  [R0603_L]
R110  1K  [R0603_L]
R111  1K  [R0603_L]
R112  2.2K  [R0603_L]
R114  6.8K
R115  6.8K
R118  3.6K
R119  1K
R120  1K
R122  1K
R133  1K
R148  1K
R149  1K
SL1  SLA-05VDC-SL-A  [SLA-05VDC-SL-A]
SRD1  SRD-05VDC-SL-C  [SRD-05VDC-SL-C]
SRD2  SRD-05VDC-SL-C  [SRD-05VDC-SL-C]
T1  XT60
T2  XT60
U12  AMS1117-3.3  [AMS1117-3.3]
U14  LP5300B6F  [LP5300B6F]
U15  LP5300B6F  [LP5300B6F]
U19  LM358B  [LM358B]
U22  ACS712ELCTR-05B  [ACS712ELCTR-05B]
U23  48_to_24  [48_to_24]
U24  48_to_24  [48_to_24]
U25  48_to_12  [48_to_12]
U26  5v_temp  [5v_temp]
U27  5v_temp  [5v_temp]

### Nets
5_A_V: C21.2 C25.2 C28.1 C29.1 R133.2 U12.3(VIN) U14.4(VOUT) U22.8(VCC)
5_A_V_IN: C22.2 C32.2 D28.1(K) U14.3(VIN) U15.3(VIN)
5_B_V: D8.1(K) D9.1(K) D10.1(K) D29.1(K) SL1.3 SRD1.4 SRD2.4
5V_32: C23.2 U15.4(VOUT)
12V: D27.1(K) FAN.1 R2.1 SRD2.5 U26.3(IN) U26.4(IN) U27.3(IN) U27.4(IN)
+A3.3V: C30.1 C31.1 R120.1 U12.2(VOUT) U12.4(VOUT) U19.8(V+)
GND: C16.2 C21.1 C22.1 C23.1 C25.1 C28.2 C29.2 C30.2 C31.2 C32.1 D5.2(A) D6.2(A) FAN.2 LED_3.3.2(K) LED_5A.2(K) LED_5B.2(K) LED_12.2(K) LED_24.2(K) LED_24_B.2(K) NBREAK1.1 NBREAK2.1 NPN1.2(E) NPN2.2(E) NPN3.2(E) NPN4.2(E) R110.1 R111.2 SL1.5 T1.3 T1.4 T2.1(-) T2.3 T2.4 U12.1(ADJ/GND) U14.1(GND) U14.2(GND) U14.5(GND) U14.6(GND) U15.1(GND) U15.2(GND) U15.5(GND) U15.6(GND) U19.4(V-) U22.5(GND) U23.1(GND) U23.2(GND) U24.1(GND) U24.2(GND) U25.1(GND) U25.2(GND) U26.1(GND) U26.2(GND) U26.5(GND) U26.6(GND) U27.1(GND) U27.2(GND) U27.5(GND) U27.6(GND)
MOTOR_1_1: D1.1(K) D23.1(K) R4.1  [also labelled VCCIN_24_A_1]
MOTOR_2_1: D2.1(K) D24.1(K) R3.1  [also labelled VCCIN_24_A_2]
VIN: D3.1(K) D4.1(K) R1.2 R3.2 R4.2 R109.2 T2.2(+) U23.3(IN) U24.3(IN) U25.3(IN)
AD5: C15.1 D7.1(K)
AD6: R112.1 U19.1(OUT1)
MOTOR_1_2: D23.2(A)
MOTOR_2_2: D24.2(A) R27.2 R28.2 U22.1(IP+) U22.2(IP+)
PA5_PWM1: R149.1
PC0: R148.1
PF8_OUT: R8.1
PF10_OUT: R6.1
SW2: SRD2.2
SW3: NBREAK2.2 SRD1.2
SW_IN: R1.1 R2.2 SRD1.5
NetC15_2: C15.2 R11.2
NetC16_1: C16.1 U22.6(FILTER)
NetD1_2: D1.2(A) R114.1 U24.0(OUT)
NetD2_2: D2.2(A) R115.1 U23.0(OUT)
NetD3_2: D3.2(A) D4.2(A) T1.2(+)
NetD5_1: D5.1(K) D6.1(K) T1.1(-)
NetD7_2: D7.2(A) R11.1 R12.1
NetD8_2: D8.2(A) NPN2.3(C) SRD2.1
NetD9_2: D9.2(A) NPN4.3(C) SL1.4
NetD10_2: D10.2(A) NPN3.3(C) SRD1.1
NetD25_1: D25.1(K) D26.1(K) NBREAK1.2 SL1.2
NetD25_2: D25.2(A) D26.2(A) R27.1 R28.1 U22.3(IP-) U22.4(IP-)
NetD27_2: D27.2(A) R118.1 U25.0(OUT)
NetD28_2: D28.2(A) R119.1 U26.7(OUT) U26.8(OUT)
NetD29_2: D29.2(A) R122.2 U27.7(OUT) U27.8(OUT)
NetLED_1_1: LED_1.1(A) R133.1
NetLED_1_2: LED_1.2(K) NPN1.3(C)
NetLED_3.3_1: LED_3.3.1(A) R120.2
NetLED_5A_1: LED_5A.1(A) R119.2
NetLED_5B_1: LED_5B.1(A) R122.1
NetLED_12_1: LED_12.1(A) R118.2
NetLED_24_1: LED_24.1(A) R114.2
NetLED_24_B_1: LED_24_B.1(A) R115.2
NetNPN1_1: NPN1.1(B) R148.2
NetNPN2_1: NPN2.1(B) R8.2
NetNPN3_1: NPN3.1(B) R6.2
NetNPN4_1: NPN4.1(B) R149.2
NetR12_2: R12.2 U22.7(VIOUT)
NetR109_1: R109.1 R110.2 U19.3(IN1+)
NetR111_1: R111.1 R112.2 U19.2(IN1-)

Not connected (* = marked no-connect by the designer): SRD1 3; SRD2 3; U19 5(IN2+) 6(IN2-) 7(OUT2)

### Notes on the sheet
- (near U26) 5_A_V(1.5A)
- (near U27) 5_B_V(1.5A)
- (near U25) 12V
- (near U24) 24V
- (near U23) 24V
- VIN=46V~54V
- 强制不刹车1
- 继电器
- R1或R2只焊接1个,默认焊接R1
- (near SRD2) 继电器
- (near FAN) 风扇
- R3、R4默认不焊接
- R27、R28默认不焊接
- (near C30) 3.3V
- 刹车电流检测/电池电压检测
- 48V 降压至 0.84V
- Labels drawn without touching a wire or pin: PA0, PA1_OUT, PE7_OUT, PG5

### Library data of the parts
C15 C16 C21-C23 C25 C28 C31 C32 = Cap: Capacitor; Published: 8-Jun-2000; LatestRevisionDate: 17-Jul-2002; LatestRevisionNote: Re-released for DXP Platform.; PackageReference: RAD-0.3; Publisher: Altium Limited; PackageDescription: Radial Cap, Thru-Hole; 2 Leads; 0.3 in Pin Spacing
  C15 C21 C28 C31: Value: 100nF/50V
  C16: Value: 1nF/50V
  C22 C23 C25 C32: Value: 1UF/50V
D7 = 1N4448: Manufacturer: Diodes Inc; Manufacturer Part: 1N4448HLP-7; Link: https://www.diodes.com/assets/Datasheets/ds30590.pdf; Digikey: 1N4448HLPDICT-ND; Avnet: 1N4448HLP-7; spicePre: D; spiceSymbolName: 1N4448
LED_3.3 LED_5A LED_5B LED_12 LED_24 LED_24_B = LED: as LED_IN0 on sheet 407-exp
R1-R4 R6 R8 R12 R27 R28 R133 R148 R149 = Res2: Resistor; Published: 8-Jun-2000; LatestRevisionDate: 17-Jul-2002; LatestRevisionNote: Re-released for DXP Platform.; PackageReference: AXIAL-0.4; Publisher: Altium Limited; PackageDescription: Axial Device, Thru-Hole; 2 Leads; 0.4 in Pin Spacing
  R1-R4 R27 R28: Value: 0R
  R6 R8 R12 R133 R148 R149: Value: 1K
R11 = Res2: Resistor; Value: 1K; Published: 8-Jun-2000; LatestRevisionDate: 17-Jul-2002; LatestRevisionNote: Re-released for DXP Platform.; PackageReference: AXIAL-0.4; Publisher: Altium Limited; PackageDescription: Axial Device, Thru-Hole; 2 Leads; 0.4 in Pin Spacing
R109-R112 = Res2: Resistor; Value: 0K; Published: 8-Jun-2000; LatestRevisionDate: 17-Jul-2002; LatestRevisionNote: Re-released for DXP Platform.; PackageReference: AXIAL-0.4; Publisher: Altium Limited; PackageDescription: Axial Device, Thru-Hole; 2 Leads; 0.4 in Pin Spacing
R114 R115 R118-R120 R122 = R: 贴片电阻; 联系卖家，免费查找封装: 唯一出售店铺网址https://shop463601444.taobao.com; BOM名称: 贴片电阻

## Nets that join several sheets
5_A_V: 407-io (12 pins), 407-485 (36 pins), 407-exp (23 pins), 407-power (8 pins)
5_B_V: 407-exp (J1.8 J2.8), 407-power (7 pins)
5V_32: 407-io (8 pins), 407-power (C23.2 U15.4)
12V: 407-io (U11.4), 407-exp (T4.1 T4.2 T5.1 T5.2), 407-power (8 pins)
+A3.3V: 407-cpu  (32 pins), 407-io (9 pins), 407-485 (R102.2), 407-exp (7 pins), 407-power (6 pins)
GND: 407-cpu  (35 pins), 407-io (37 pins), 407-485 (31 pins), 407-exp (54 pins), 407-power (58 pins)
MOTOR_1_1: 407-exp (J2.24 J2.25), 407-power (D1.1 D23.1 R4.1)
MOTOR_2_1: 407-exp (J1.24 J1.25), 407-power (D2.1 D24.1 R3.1)
A_1: 407-485 (R74.1 T8.7), 407-exp (J1.14 J2.14)
A_2: 407-485 (R76.1 T8.2), 407-exp (J1.15 J2.15)
AD1: 407-io (U17.4), 407-exp (J2.7)
AD2: 407-io (U17.5), 407-exp (J1.20)
AD3: 407-io (U17.7), 407-exp (J2.20)
AD4: 407-io (U17.6), 407-exp (J1.7)
AD5: 407-io (U18.4), 407-power (C15.1 D7.1)
AD6: 407-io (U18.5), 407-power (R112.1 U19.1)
B_1: 407-485 (R73.1 T8.6), 407-exp (J1.1 J2.1)
B_2: 407-485 (R75.1 T8.3), 407-exp (J1.2 J2.2)
CANH: 407-io (R136.2 U13.7), 407-exp (T5.12)
CANL: 407-io (R136.1 U13.6), 407-exp (T5.10)
GPS: 407-cpu  (U1.128), 407-485 (DTU.6)
MOTOR_1_2: 407-exp (J2.12 J2.13), 407-power (D23.2)
MOTOR_2_2: 407-exp (J1.12 J1.13), 407-power (5 pins)
PA0: 407-cpu  (U1.34), 407-485 (DTU.3)
PA1: 407-cpu  (U1.35), 407-485 (DTU.4)
PA2: 407-cpu  (U1.36), 407-485 (R49.1 U10.4)
PA3: 407-cpu  (U1.37), 407-485 (R51.1 U10.1)
PA4: 407-cpu  (U1.40), 407-exp (U3.6)
PA5: 407-cpu  (U1.41), 407-exp (R32.2 U2.6)
PA5_PWM1: 407-exp (U2.14), 407-power (R149.1)
PA6: 407-cpu  (U1.42), 407-exp (R10.1)
PA7: 407-cpu  (U1.43), 407-exp (R9.1 R105.1)
PA8: 407-cpu  (U1.100), 407-io (R47.1 U16.6)
PA9: 407-cpu  (U1.101), 407-io (T10.6)
PA10: 407-cpu  (U1.102), 407-io (uart_sbus.13)
PA11: 407-cpu  (U1.103), 407-exp (R31.2 U2.3)
PA12: 407-cpu  (U1.104), 407-exp (R30.2 U2.5)
PA15: 407-cpu  (U1.110), 407-io (T10.3)
PB0: 407-cpu  (U1.46), 407-exp (R7.1)
PB1: 407-cpu  (U1.47), 407-exp (R5.1)
PB3: 407-cpu  (U1.133), 407-io (T10.1), 407-exp (R106.1)
PB4: 407-cpu  (U1.134), 407-io (T9.1)
PB5: 407-cpu  (U1.135), 407-io (T9.2)
PB6: 407-cpu  (U1.136), 407-io (T9.3)
PB7: 407-cpu  (U1.137), 407-io (T9.4)
PB8: 407-cpu  (U1.139), 407-io (R45.2 U17.10)
PB9: 407-cpu  (U1.140), 407-io (R44.2 U17.9)
PB10: 407-cpu  (U1.69), 407-io (R104.2 U18.10)
PB11: 407-cpu  (U1.70), 407-io (R103.2 U18.9)
PB12: 407-cpu  (U1.73), 407-io (NRF.3)
PB13: 407-cpu  (U1.74), 407-io (NRF.4)
PB14: 407-cpu  (U1.75), 407-io (NRF.5)
PB15: 407-cpu  (U1.76), 407-io (NRF.6)
PC0: 407-cpu  (U1.26), 407-power (R148.1)
PC1: 407-cpu  (U1.27), 407-exp (U3.9)
PC2: 407-cpu  (U1.28), 407-exp (U3.8)
PC3: 407-cpu  (U1.29), 407-exp (U3.7)
PC4: 407-cpu  (U1.44), 407-exp (U3.5)
PC5: 407-cpu  (U1.45), 407-exp (U3.4)
PC6: 407-cpu  (U1.96), 407-485 (R15.2 R25.1)
PC7: 407-cpu  (U1.97), 407-485 (R16.2 R26.2)
PC8: 407-cpu  (U1.98), 407-io (T10.4)
PC9: 407-cpu  (U1.99), 407-io (R48.1 U16.5)
PC10: 407-cpu  (U1.111), 407-485 (R55.1 U9.4)
PC11: 407-cpu  (U1.112), 407-485 (R57.1 U9.1)
PC12: 407-cpu  (U1.113), 407-485 (R13.2 R23.1)
PD0: 407-cpu  (U1.114), 407-io (U13.4)
PD1: 407-cpu  (U1.115), 407-io (U13.1)
PD2: 407-cpu  (U1.116), 407-485 (R14.2 R24.1)
PD3: 407-cpu  (U1.117), 407-exp (R84.2 U6.6)
PD4: 407-cpu  (U1.118), 407-exp (R82.2 U6.5)
PD5: 407-cpu  (U1.119), 407-exp (R85.2 U6.4)
PD6: 407-cpu  (U1.122), 407-exp (R83.2 U6.3)
PD7: 407-cpu  (U1.123), 407-exp (R86.2 U6.2)
PD8: 407-cpu  (U1.77), 407-io (NRF.7)
PD9: 407-cpu  (U1.78), 407-exp (R106.2 U5.3)
PD10: 407-cpu  (U1.79), 407-exp (U5.4)
PD11: 407-cpu  (U1.80), 407-exp (U5.5)
PD12: 407-cpu  (U1.81), 407-exp (U5.6)
PD13: 407-cpu  (U1.82), 407-exp (U5.7)
PD14: 407-cpu  (U1.85), 407-exp (U5.8)
PD15: 407-cpu  (U1.86), 407-io (T10.2)
PE4: 407-cpu  (U1.3), 407-exp (R81.2 U6.7)
PE5: 407-cpu  (U1.4), 407-exp (R88.2 U6.8)
PE6: 407-cpu  (U1.5), 407-exp (R87.2 U6.9)
PE7: 407-cpu  (U1.58), 407-io (NRF.2)
PE8: 407-cpu  (U1.59), 407-exp (R19.2 U4.3)
PE9: 407-cpu  (U1.60), 407-exp (R22.2 U4.2)
PE10: 407-cpu  (U1.63), 407-io (T10.9)
PE11: 407-cpu  (U1.64), 407-exp (R20.2 U4.6)
PE12: 407-cpu  (U1.65), 407-io (T10.5)
PE13: 407-cpu  (U1.66), 407-exp (R125.2 U2.2)
PE14: 407-cpu  (U1.67), 407-exp (R33.2 U2.4)
PE15: 407-cpu  (U1.68), 407-io (T10.7)
PF0: 407-cpu  (U1.10), 407-485 (MPU.5)
PF1: 407-cpu  (U1.11), 407-485 (MPU.6)
PF3: 407-cpu  (U1.13), 407-exp (R105.2 U5.2)
PF5: 407-cpu  (U1.15), 407-485 (R101.1 R102.1 T11.2)
PF6: 407-cpu  (U1.18), 407-exp (R18.2 U4.5)
PF7: 407-cpu  (U1.19), 407-exp (R21.2 U4.4)
PF8: 407-cpu  (U1.20), 407-exp (R94.2 U4.8)
PF8_OUT: 407-exp (U4.12), 407-power (R8.1)
PF9: 407-cpu  (U1.21), 407-exp (R17.2 U4.7)
PF10: 407-cpu  (U1.22), 407-exp (R93.2 U4.9)
PF10_OUT: 407-exp (U4.11), 407-power (R6.1)
PF11: 407-cpu  (U1.49), 407-io (DS1.3)
PF12: 407-cpu  (U1.50), 407-exp (U3.3)
PF13: 407-cpu  (U1.53), 407-io (DS1.2)
PF14: 407-cpu  (U1.54), 407-io (DS1.1)
PF15: 407-cpu  (U1.55), 407-exp (U3.2)
PG3: 407-cpu  (U1.88), 407-io (MP3.6)
PG4: 407-cpu  (U1.89), 407-io (MP3.5)
PG5: 407-cpu  (U1.90), 407-io (MP3.4)
PG6: 407-cpu  (U1.91), 407-io (MP3.3)
PG7: 407-cpu  (U1.92), 407-io (MP3.2)
PG8: 407-cpu  (U1.93), 407-io (MP3.1)
PG12: 407-cpu  (U1.127), 407-485 (DTU.5)
SW2: 407-exp (J1.11 J2.11), 407-power (SRD2.2)